# Altium schematic sheet Description.SchDoc: Description
size A4; Author: Daniel Sinko; Revision: A; SheetNumber: 1; SheetTotal: 15
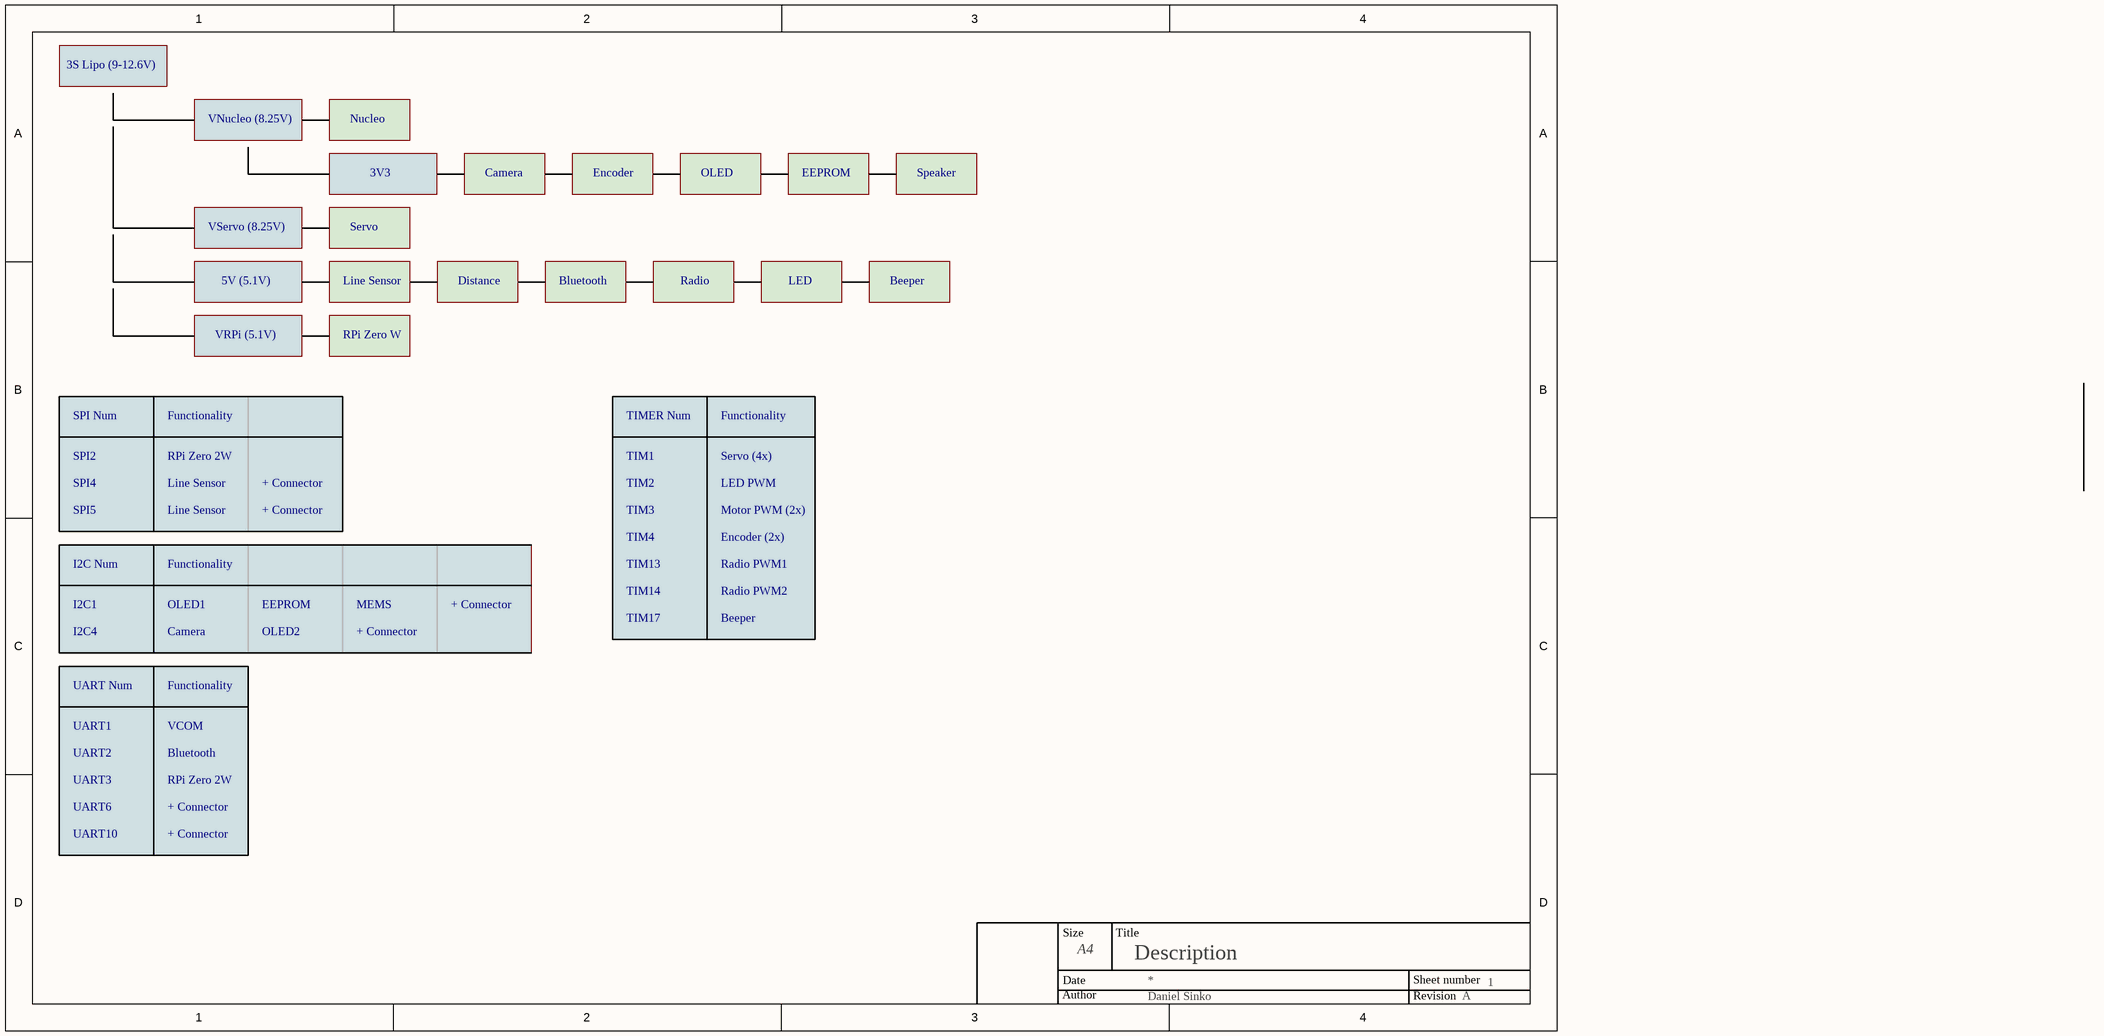
[diagram p0: Description.SchDoc]

## Notes on the sheet
- 3S Lipo (9-12.6V)
- VNucleo (8.25V)
- Nucleo
- 3V3
- Camera
- Encoder
- OLED
- EEPROM
- Speaker
- VServo (8.25V)
- Servo
- 5V (5.1V)
- Line Sensor
- Distance
- Bluetooth
- Radio
- LED
- Beeper
- VRPi (5.1V)
- RPi Zero W
- SPI Num
- Functionality
- TIMER Num
- SPI2
- SPI4
- SPI5
- RPi Zero 2W
- + Connector
- TIM1
- TIM2
- TIM3
- Servo (4x)
- LED PWM
- Motor PWM (2x)
- I2C Num
- TIM4
- TIM13
- Encoder (2x)
- Radio PWM1
- I2C1
- I2C4
- OLED1
- OLED2
- MEMS
- TIM14
- TIM17
- Radio PWM2
- UART Num
- UART1
- UART2
- UART3
- VCOM
- UART6
- UART10
- Size
- Date
- A4
- Title
- Sheet number
- Author
- Revision